# Altium project S12642_0404_etap3_v1.PrjPcb
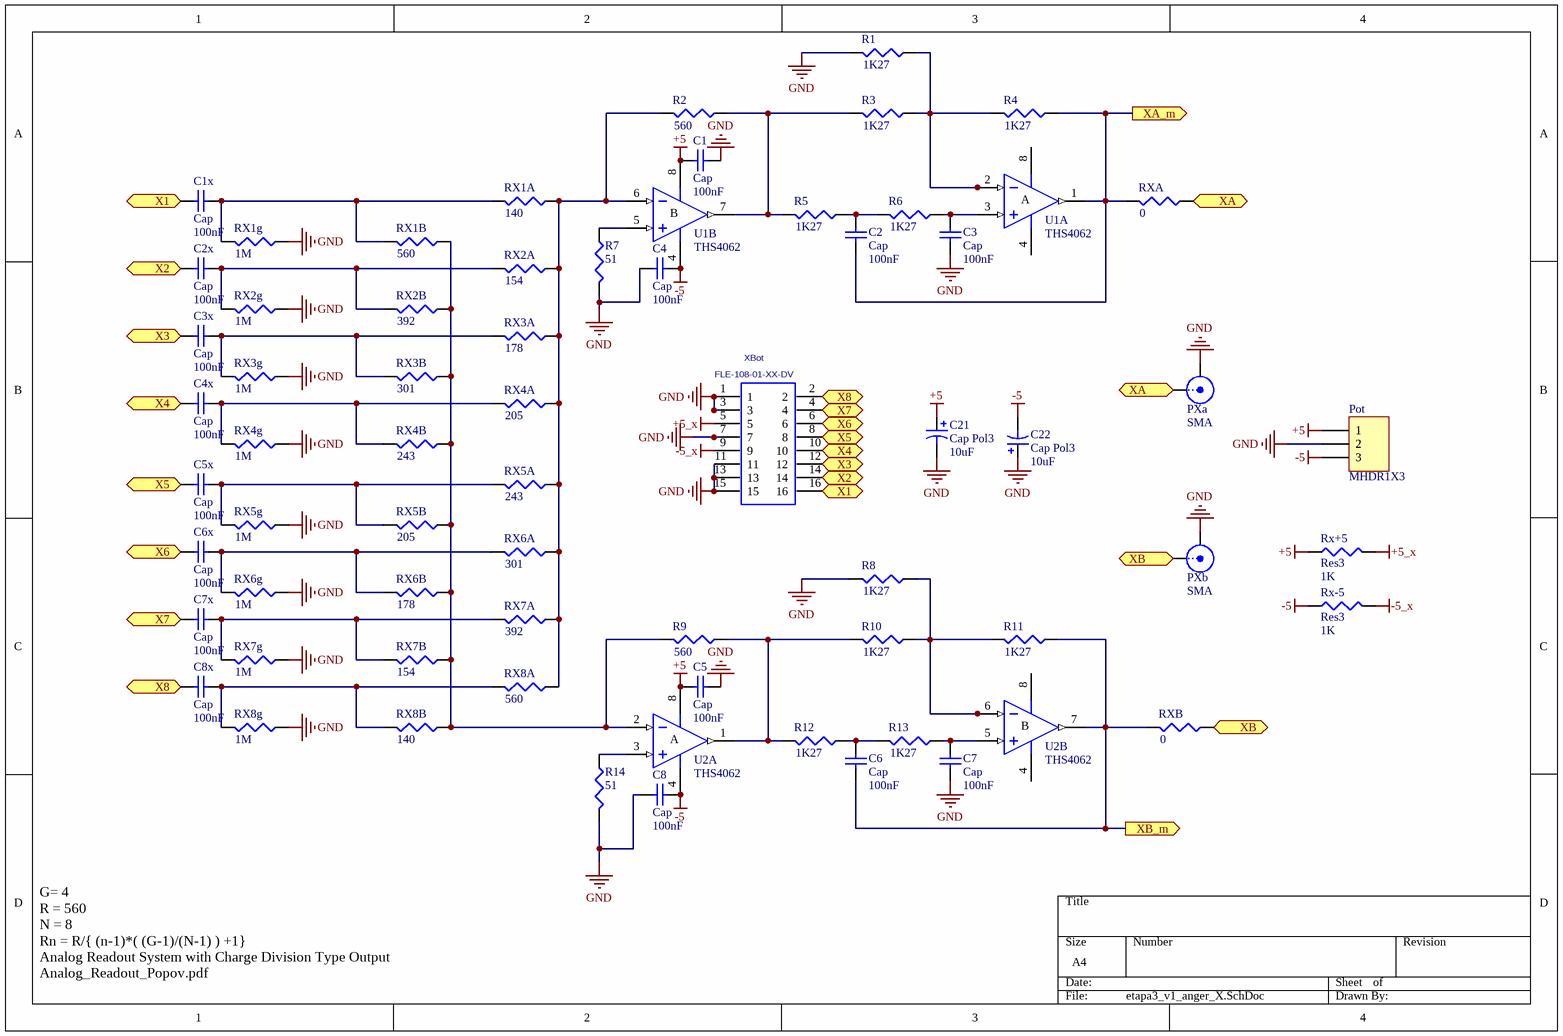
[diagram p0: etapa3_v1_anger_X.SchDoc]
3 sheets, 168 parts. Net scope: flat (ports and power ports of the same name join across sheets).
Board file: etapa_3_v1.PcbDoc
Sheets:
  etapa3_v1_anger_X.SchDoc
  etapa3_v1_anger_Y.SchDoc
  etapa3_v1_timing_1.SchDoc

## Sheet etapa3_v1_anger_X.SchDoc
size A4

### Parts
C1  Cap  value 100nF  [0402]
C1x  Cap  value 100nF  [0402]
C2  Cap  value 100nF  [0402]
C2x  Cap  value 100nF  [0402]
C3  Cap  value 100nF  [0402]
C3x  Cap  value 100nF  [0402]
C4  Cap  value 100nF  [0402]
C4x  Cap  value 100nF  [0402]
C5  Cap  value 100nF  [0402]
C5x  Cap  value 100nF  [0402]
C6  Cap  value 100nF  [0402]
C6x  Cap  value 100nF  [0402]
C7  Cap  value 100nF  [0402]
C7x  Cap  value 100nF  [0402]
C8  Cap  value 100nF  [0402]
C8x  Cap  value 100nF  [0402]
C21  Cap Pol3  value 10uF  [1608[0603]]
C22  Cap Pol3  value 10uF  [1608[0603]]
Pot  MHDR1X3  [MHDR1X3]
PXa  SMA  [SMB_V-RJ45]
PXb  SMA  [SMB_V-RJ45]
R1  value 1K27  [0402]  (hidden comment: Res3)
R2  value 560  [0402]  (hidden comment: Res3)
R3  value 1K27  [0402]  (hidden comment: Res3)
R4  value 1K27  [0402]  (hidden comment: Res3)
R5  value 1K27  [0402]  (hidden comment: Res3)
R6  value 1K27  [0402]  (hidden comment: Res3)
R7  value 51  [0402]  (hidden comment: Res3)
R8  value 1K27  [0402]  (hidden comment: Res3)
R9  value 560  [0402]  (hidden comment: Res3)
R10  value 1K27  [0402]  (hidden comment: Res3)
R11  value 1K27  [0402]  (hidden comment: Res3)
R12  value 1K27  [0402]  (hidden comment: Res3)
R13  value 1K27  [0402]  (hidden comment: Res3)
R14  value 51  [0402]  (hidden comment: Res3)
RX1A  value 140  [0402]  (hidden comment: Res3)
RX1B  value 560  [0402]  (hidden comment: Res3)
RX1g  value 1M  [0402]  (hidden comment: Res3)
RX2A  value 154  [0402]  (hidden comment: Res3)
RX2B  value 392  [0402]  (hidden comment: Res3)
RX2g  value 1M  [0402]  (hidden comment: Res3)
RX3A  value 178  [0402]  (hidden comment: Res3)
RX3B  value 301  [0402]  (hidden comment: Res3)
RX3g  value 1M  [0402]  (hidden comment: Res3)
RX4A  value 205  [0402]  (hidden comment: Res3)
RX4B  value 243  [0402]  (hidden comment: Res3)
RX4g  value 1M  [0402]  (hidden comment: Res3)
RX5A  value 243  [0402]  (hidden comment: Res3)
RX5B  value 205  [0402]  (hidden comment: Res3)
RX5g  value 1M  [0402]  (hidden comment: Res3)
RX6A  value 301  [0402]  (hidden comment: Res3)
RX6B  value 178  [0402]  (hidden comment: Res3)
RX6g  value 1M  [0402]  (hidden comment: Res3)
RX7A  value 392  [0402]  (hidden comment: Res3)
RX7B  value 154  [0402]  (hidden comment: Res3)
RX7g  value 1M  [0402]  (hidden comment: Res3)
RX8A  value 560  [0402]  (hidden comment: Res3)
RX8B  value 140  [0402]  (hidden comment: Res3)
RX8g  value 1M  [0402]  (hidden comment: Res3)
Rx+5  Res3  value 1K  [J1-0603]
Rx-5  Res3  value 1K  [J1-0603]
RXA  value 0  [0402]  (hidden comment: Res3)
RXB  value 0  [0402]  (hidden comment: Res3)
U1  THS4062  [SO-8_M]  (parts A,B of 2)
U2  THS4062  [SO-8_M]  (parts A,B of 2)
XBot  FLE-108-01-XX-DV  [FLE-108-01-XX-DV]

### Ports
X1 (out), X2 (out), X3 (out), X4 (out), X5 (out), X6 (out), X7 (out), X8 (out), XA (out), XA_m (out), XB (out), XB_m (out)

### Nets
+5: C1.1 C5.1 C21.1 Pot.1 Rx+5.1 U1.8(V+) U2.8(V+)
+5_x: Rx+5.2 XBot.5
-5: C4.2 C8.2 C22.2 Pot.3 Rx-5.1 U1.4(V-) U2.4(V-)
-5_x: Rx-5.2 XBot.9
GND: C1.2 C3.2 C4.1 C5.2 C7.2 C8.1 C21.2 C22.1 Pot.2 PXa.2(Y) PXb.2(Y) R1.2 R7.2 R8.2 R14.2 RX1g.1 RX2g.1 RX3g.1 RX4g.1 RX5g.1 RX6g.1 RX7g.1 RX8g.1 XBot.1 XBot.3 XBot.7 XBot.11 XBot.13 XBot.15
NetC1x_1: C1x.1 XBot.16 ; port X1
NetC1x_2: C1x.2 RX1A.2 RX1B.2 RX1g.2
NetC2_1: C2.1 R5.1 R6.2
NetC2_2: C2.2 R4.1 RXA.2 U1.1(OUT) ; port XA_m
NetC2x_1: C2x.1 XBot.14 ; port X2
NetC2x_2: C2x.2 RX2A.2 RX2B.2 RX2g.2
NetC3_1: C3.1 R6.1 U1.3(IN+)
NetC3x_1: C3x.1 XBot.12 ; port X3
NetC3x_2: C3x.2 RX3A.2 RX3B.2 RX3g.2
NetC4x_1: C4x.1 XBot.10 ; port X4
NetC4x_2: C4x.2 RX4A.2 RX4B.2 RX4g.2
NetC5x_1: C5x.1 XBot.8 ; port X5
NetC5x_2: C5x.2 RX5A.2 RX5B.2 RX5g.2
NetC6_1: C6.1 R12.1 R13.2
NetC6_2: C6.2 R11.1 RXB.2 U2.7(OUT) ; port XB_m
NetC6x_1: C6x.1 XBot.6 ; port X6
NetC6x_2: C6x.2 RX6A.2 RX6B.2 RX6g.2
NetC7_1: C7.1 R13.1 U2.5(IN+)
NetC7x_1: C7x.1 XBot.4 ; port X7
NetC7x_2: C7x.2 RX7A.2 RX7B.2 RX7g.2
NetC8x_1: C8x.1 XBot.2 ; port X8
NetC8x_2: C8x.2 RX8A.2 RX8B.2 RX8g.2
NetPXa_1: PXa.1(X) RXA.1 ; port XA
NetPXb_1: PXb.1(X) RXB.1 ; port XB
NetR1_1: R1.1 R3.1 R4.2 U1.2(IN-)
NetR2_1: R2.1 R3.2 R5.2 U1.7(OUT)
NetR2_2: R2.2 RX1A.1 RX2A.1 RX3A.1 RX4A.1 RX5A.1 RX6A.1 RX7A.1 RX8A.1 U1.6(IN-)
NetR7_1: R7.1 U1.5(IN+)
NetR8_1: R8.1 R10.1 R11.2 U2.6(IN-)
NetR9_1: R9.1 R10.2 R12.2 U2.1(OUT)
NetR9_2: R9.2 RX1B.1 RX2B.1 RX3B.1 RX4B.1 RX5B.1 RX6B.1 RX7B.1 RX8B.1 U2.2(IN-)
NetR14_1: R14.1 U2.3(IN+)

### Notes on the sheet
- G= 4
  R = 560
  N = 8
  Rn = R/{ (n-1)*( (G-1)/(N-1) ) +1}
  Analog Readout System with Charge Division Type Output
  Analog_Readout_Popov.pdf
- (in symbol AD8002AR, part A) A
- (in symbol AD8002AR, part B) B

### Library data of the parts
C1 C1x C2 C2x C3 C3x C4 C4x C5 C5x C6 C6x C7 C7x C8 C8x = Cap: Capacitor; Published: 8-Jun-2000; LatestRevisionDate: 17-Jul-2002; LatestRevisionNote: Re-released for DXP Platform.; PackageReference: RAD-0.3; Publisher: Altium Limited; PackageDescription: Radial Cap, Thru-Hole; 2 Leads; 0.3 in Pin Spacing
C21 C22 = Cap Pol3: Polarized Capacitor (Surface Mount); Published: 8-Jun-2000; LatestRevisionDate: 29-May-2009; LatestRevisionNote: IPC-7351 Footprint Added.; PackageReference: C0805; Publisher: Altium Limited; PackageDescription: Chip Capacitor
Pot = MHDR1X3: Header, 3-Pin; LatestRevisionDate: 17-Jul-2002; LatestRevisionNote: Re-released for DXP Platform.; Publisher: Altium Limited
PXa PXb = SMB: SMB Straight Connector; LatestRevisionDate: 17-Jul-2002; LatestRevisionNote: Re-released for DXP Platform.; Publisher: Altium Limited
R1-R14 RX1A RX1B RX1g RX2A RX2B RX2g RX3A RX3B RX3g RX4A RX4B RX4g RX5A RX5B RX5g RX6A RX6B RX6g RX7A RX7B RX7g RX8A RX8B RX8g Rx+5 Rx-5 RXA RXB = Res3: Resistor; Published: 8-Jun-2000; LatestRevisionDate: 29-May-2009; LatestRevisionNote: IPC-7351 Footprint Added.; PackageReference: J1-0603; Publisher: Altium Limited; PackageDescription: Chip Resistor
U1 U2 = AD8002AR: Dual 600MHz, 50mW Current Feedback Amplifier; Published: 8-Jun-2000; LatestRevisionDate: 13-Apr-2006; LatestRevisionNote: IPC-7351 Footprint Added.; DatasheetVersion: REV. C 1999; PackageVersion: revA; PackageReference: SO-8; Publisher: Altium Limited; PackageDescription: 8-Pin Small Outline Integrated Circuit 1.27 mm Pitch; Code_JEDEC: MS-012-AA; Code_IPC: SOIC127P600-8; ComponentLink1Description: Manufacturer Link; ComponentLink1URL: http://www.analog.com/en/prod/0,,759_786_AD8002%2C00.html; ComponentLink2Description: Datasheet; ComponentLink2URL: http://www.analog.com/UploadedFiles/Data_Sheets/147523773AD8002_d.pdf
XBot = FLE-108-01-XX-DV: DUAL ROW 0.050'' STRIP ASSEMBLY.; MANUFACTURER: SAMTEC; CREATED: December 2, 2014 - Wendy Xin; PCB DECAL: FLE-108-01-XX-DV

## Sheet etapa3_v1_anger_Y.SchDoc
size A4
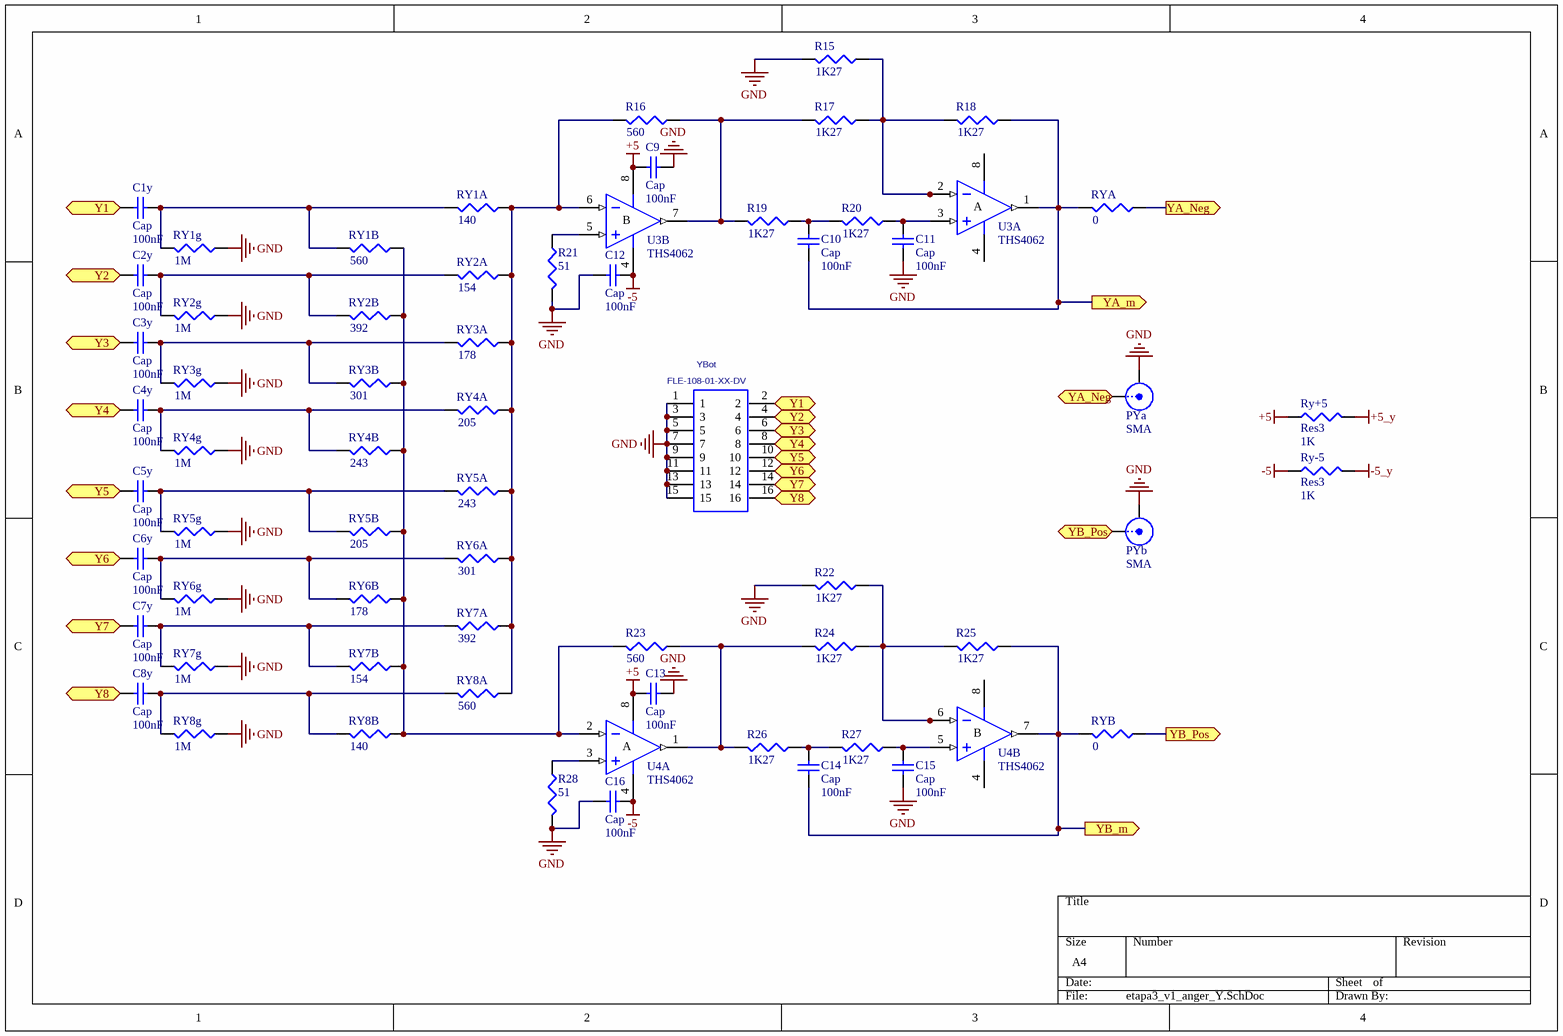
[diagram p1: etapa3_v1_anger_Y.SchDoc]

### Parts
(Parts that share a designator on the sheet are numbered #1, #2 ... from top to bottom, then left to right.)
C1y  Cap  value 100nF  [0402]
C2y  Cap  value 100nF  [0402]
C3y  Cap  value 100nF  [0402]
C4y  Cap  value 100nF  [0402]
C5y  Cap  value 100nF  [0402]
C6y  Cap  value 100nF  [0402]
C7y  Cap  value 100nF  [0402]
C8y  Cap  value 100nF  [0402]
C9#1  Cap  value 100nF  [0402]
C10#1  Cap  value 100nF  [0402]
C11#1  Cap  value 100nF  [0402]
C12#1  Cap  value 100nF  [0402]
C13#1  Cap  value 100nF  [0402]
C14#1  Cap  value 100nF  [0402]
C15#1  Cap  value 100nF  [0402]
C16  Cap  value 100nF  [0402]
PYa  SMA  [SMB_V-RJ45]
PYb  SMA  [SMB_V-RJ45]
R15#1  value 1K27  [0402]  (hidden comment: Res3)
R16#1  value 560  [0402]  (hidden comment: Res3)
R17#1  value 1K27  [0402]  (hidden comment: Res3)
R18#1  value 1K27  [0402]  (hidden comment: Res3)
R19#1  value 1K27  [0402]  (hidden comment: Res3)
R20#1  value 1K27  [0402]  (hidden comment: Res3)
R21#1  value 51  [0402]  (hidden comment: Res3)
R22  value 1K27  [0402]  (hidden comment: Res3)
R23  value 560  [0402]  (hidden comment: Res3)
R24  value 1K27  [0402]  (hidden comment: Res3)
R25#1  value 1K27  [0402]  (hidden comment: Res3)
R26  value 1K27  [0402]  (hidden comment: Res3)
R27  value 1K27  [0402]  (hidden comment: Res3)
R28  value 51  [0402]  (hidden comment: Res3)
RY1A  value 140  [0402]  (hidden comment: Res3)
RY1B  value 560  [0402]  (hidden comment: Res3)
RY1g  value 1M  [0402]  (hidden comment: Res3)
RY2A  value 154  [0402]  (hidden comment: Res3)
RY2B  value 392  [0402]  (hidden comment: Res3)
RY2g  value 1M  [0402]  (hidden comment: Res3)
RY3A  value 178  [0402]  (hidden comment: Res3)
RY3B  value 301  [0402]  (hidden comment: Res3)
RY3g  value 1M  [0402]  (hidden comment: Res3)
RY4A  value 205  [0402]  (hidden comment: Res3)
RY4B  value 243  [0402]  (hidden comment: Res3)
RY4g  value 1M  [0402]  (hidden comment: Res3)
RY5A  value 243  [0402]  (hidden comment: Res3)
RY5B  value 205  [0402]  (hidden comment: Res3)
RY5g  value 1M  [0402]  (hidden comment: Res3)
RY6A  value 301  [0402]  (hidden comment: Res3)
RY6B  value 178  [0402]  (hidden comment: Res3)
RY6g  value 1M  [0402]  (hidden comment: Res3)
RY7A  value 392  [0402]  (hidden comment: Res3)
RY7B  value 154  [0402]  (hidden comment: Res3)
RY7g  value 1M  [0402]  (hidden comment: Res3)
RY8A  value 560  [0402]  (hidden comment: Res3)
RY8B  value 140  [0402]  (hidden comment: Res3)
RY8g  value 1M  [0402]  (hidden comment: Res3)
Ry+5  Res3  value 1K  [J1-0603]
Ry-5  Res3  value 1K  [J1-0603]
RYA  value 0  [0402]  (hidden comment: Res3)
RYB  value 0  [0402]  (hidden comment: Res3)
U3#1  THS4062  [SO-8_M]  (parts A,B of 2)
U4  THS4062  [SO-8_M]  (parts A,B of 2)
YBot  FLE-108-01-XX-DV  [FLE-108-01-XX-DV]

### Ports
Y1 (out), Y2 (out), Y3 (out), Y4 (out), Y5 (out), Y6 (out), Y7 (out), Y8 (out), YA_m (out), YA_Neg (out), YB_m (out), YB_Pos (out)

### Nets
+5: C9#1.1 C13#1.1 Ry+5.1 U3#1.8(V+) U4.8(V+)
+5_y: Ry+5.2
-5: C12#1.2 C16.2 Ry-5.1 U3#1.4(V-) U4.4(V-)
-5_y: Ry-5.2
GND: C9#1.2 C11#1.2 C12#1.1 C13#1.2 C15#1.2 C16.1 PYa.2(Y) PYb.2(Y) R15#1.2 R21#1.2 R22.2 R28.2 RY1g.1 RY2g.1 RY3g.1 RY4g.1 RY5g.1 RY6g.1 RY7g.1 RY8g.1 YBot.1 YBot.3 YBot.5 YBot.7 YBot.9 YBot.11 YBot.13 YBot.15
NetC1y_1: C1y.1 YBot.2 ; port Y1
NetC1y_2: C1y.2 RY1A.2 RY1B.2 RY1g.2
NetC2y_1: C2y.1 YBot.4 ; port Y2
NetC2y_2: C2y.2 RY2A.2 RY2B.2 RY2g.2
NetC3y_1: C3y.1 YBot.6 ; port Y3
NetC3y_2: C3y.2 RY3A.2 RY3B.2 RY3g.2
NetC4y_1: C4y.1 YBot.8 ; port Y4
NetC4y_2: C4y.2 RY4A.2 RY4B.2 RY4g.2
NetC5y_1: C5y.1 YBot.10 ; port Y5
NetC5y_2: C5y.2 RY5A.2 RY5B.2 RY5g.2
NetC6y_1: C6y.1 YBot.12 ; port Y6
NetC6y_2: C6y.2 RY6A.2 RY6B.2 RY6g.2
NetC7y_1: C7y.1 YBot.14 ; port Y7
NetC7y_2: C7y.2 RY7A.2 RY7B.2 RY7g.2
NetC8y_1: C8y.1 YBot.16 ; port Y8
NetC8y_2: C8y.2 RY8A.2 RY8B.2 RY8g.2
NetC10#1_1: C10#1.1 R19#1.1 R20#1.2
NetC10#1_2: C10#1.2 R18#1.1 RYA.2 U3#1.1(OUT) ; port YA_m
NetC11#1_1: C11#1.1 R20#1.1 U3#1.3(IN+)
NetC14#1_1: C14#1.1 R26.1 R27.2
NetC14#1_2: C14#1.2 R25#1.1 RYB.2 U4.7(OUT) ; port YB_m
NetC15#1_1: C15#1.1 R27.1 U4.5(IN+)
NetPYa_1: PYa.1(X) RYA.1 ; port YA_Neg
NetPYb_1: PYb.1(X) RYB.1 ; port YB_Pos
NetR15#1_1: R15#1.1 R17#1.1 R18#1.2 U3#1.2(IN-)
NetR16#1_1: R16#1.1 R17#1.2 R19#1.2 U3#1.7(OUT)
NetR16#1_2: R16#1.2 RY1A.1 RY2A.1 RY3A.1 RY4A.1 RY5A.1 RY6A.1 RY7A.1 RY8A.1 U3#1.6(IN-)
NetR21#1_1: R21#1.1 U3#1.5(IN+)
NetR22_1: R22.1 R24.1 R25#1.2 U4.6(IN-)
NetR23_1: R23.1 R24.2 R26.2 U4.1(OUT)
NetR23_2: R23.2 RY1B.1 RY2B.1 RY3B.1 RY4B.1 RY5B.1 RY6B.1 RY7B.1 RY8B.1 U4.2(IN-)
NetR28_1: R28.1 U4.3(IN+)

### Notes on the sheet
- (in symbol AD8002AR, part A) A
- (in symbol AD8002AR, part B) B

### Library data of the parts
C1y C2y C3y C4y C5y C6y C7y C8y C9#1 C10#1 C11#1 C12#1 C13#1 C14#1 C15#1 C16 = Cap: Capacitor; Published: 8-Jun-2000; LatestRevisionDate: 17-Jul-2002; LatestRevisionNote: Re-released for DXP Platform.; PackageReference: RAD-0.3; Publisher: Altium Limited; PackageDescription: Radial Cap, Thru-Hole; 2 Leads; 0.3 in Pin Spacing
PYa PYb = SMB: SMB Straight Connector; LatestRevisionDate: 17-Jul-2002; LatestRevisionNote: Re-released for DXP Platform.; Publisher: Altium Limited
R15#1 R16#1 R17#1 R18#1 R19#1 R20#1 R21#1 R22-R24 R25#1 R26-R28 RY1A RY1B RY1g RY2A RY2B RY2g RY3A RY3B RY3g RY4A RY4B RY4g RY5A RY5B RY5g RY6A RY6B RY6g RY7A RY7B RY7g RY8A RY8B RY8g Ry+5 Ry-5 RYA RYB = Res3: Resistor; Published: 8-Jun-2000; LatestRevisionDate: 29-May-2009; LatestRevisionNote: IPC-7351 Footprint Added.; PackageReference: J1-0603; Publisher: Altium Limited; PackageDescription: Chip Resistor
U3#1 U4 = AD8002AR: as U1 on sheet etapa3_v1_anger_X; Published: 8-Jun-2000; LatestRevisionDate: 13-Apr-2006; LatestRevisionNote: IPC-7351 Footprint Added.; DatasheetVersion: REV. C 1999; PackageVersion: revA; PackageReference: SO-8; Publisher: Altium Limited; PackageDescription: 8-Pin Small Outline Integrated Circuit 1.27 mm Pitch; Code_JEDEC: MS-012-AA; Code_IPC: SOIC127P600-8; ComponentLink1Description: Manufacturer Link; ComponentLink1URL: http://www.analog.com/en/prod/0,,759_786_AD8002%2C00.html; ComponentLink2Description: Datasheet; ComponentLink2URL: http://www.analog.com/UploadedFiles/Data_Sheets/147523773AD8002_d.pdf
YBot = FLE-108-01-XX-DV: as XBot on sheet etapa3_v1_anger_X; CREATED: December 2, 2014 - Wendy Xin; PCB DECAL: FLE-108-01-XX-DV

## Sheet etapa3_v1_timing_1.SchDoc
size A4
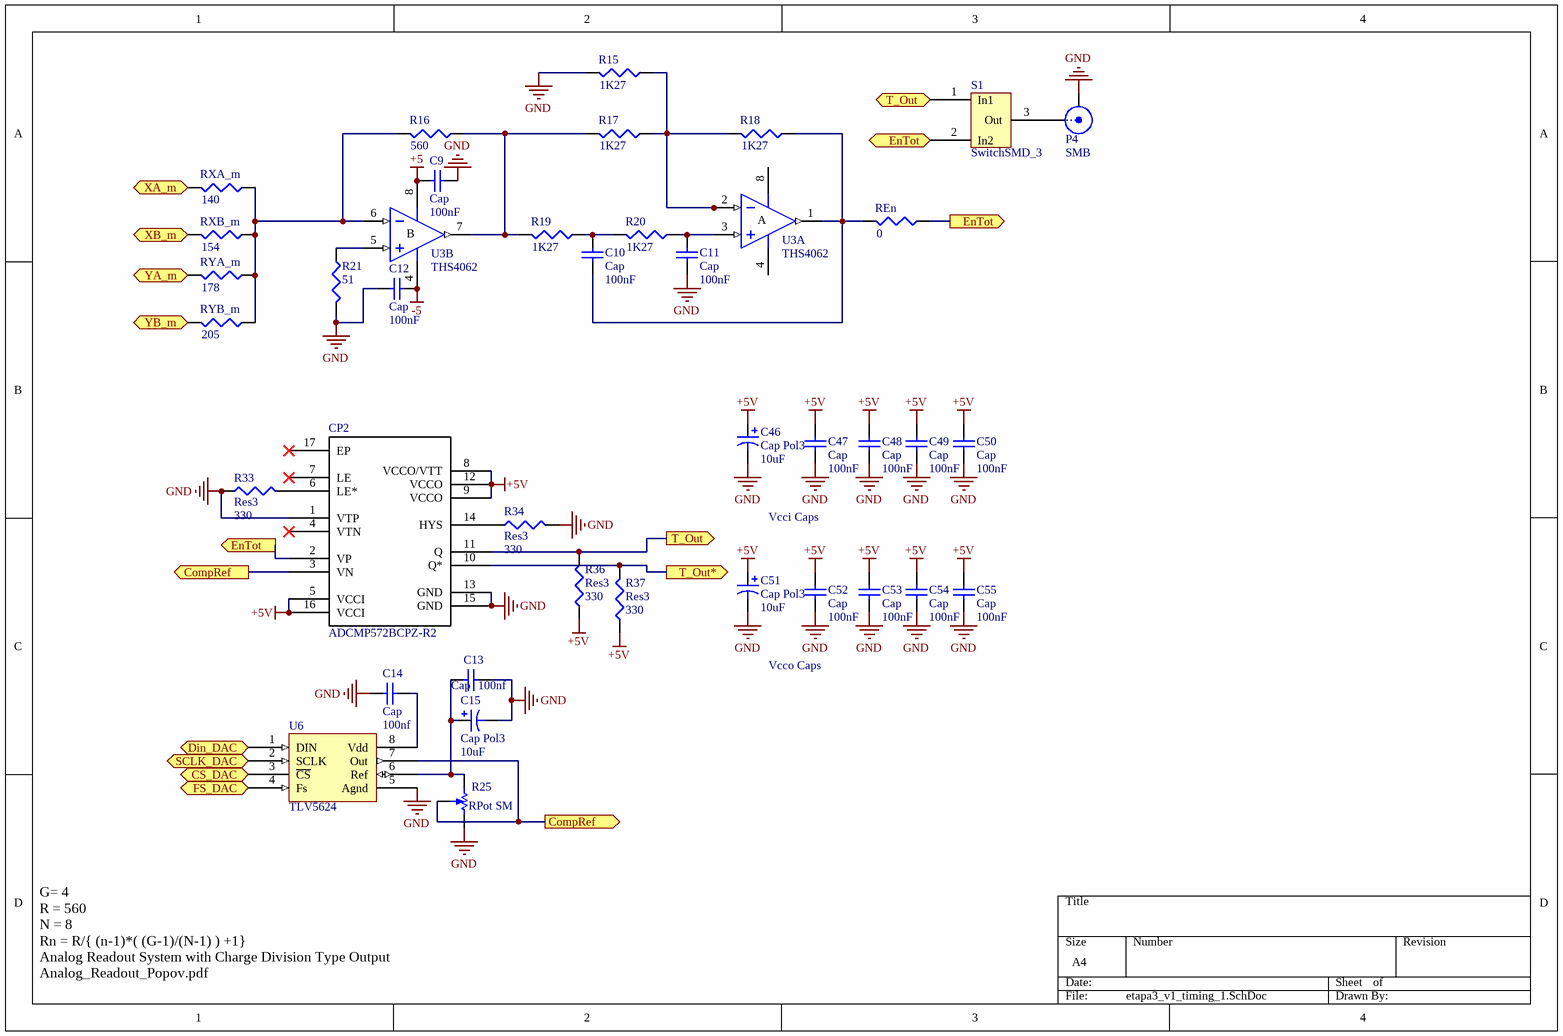
[diagram p2: etapa3_v1_timing_1.SchDoc]

### Parts
(Parts that share a designator on the sheet are numbered #1, #2 ... from top to bottom, then left to right.)
C9#2  Cap  value 100nF  [0402]
C10#2  Cap  value 100nF  [0402]
C11#2  Cap  value 100nF  [0402]
C12#2  Cap  value 100nF  [0402]
C13#2  Cap  value 100nf  [J1-0603]
C14#2  Cap  value 100nf  [J1-0603]
C15#2  Cap Pol3  value 10uF  [6-0805_N]
C46  Cap Pol3  value 10uF  [1608[0603]]
C47  Cap  value 100nF  [0402]
C48  Cap  value 100nF  [0402]
C49  Cap  value 100nF  [0402]
C50  Cap  value 100nF  [0402]
C51  Cap Pol3  value 10uF  [1608[0603]]
C52  Cap  value 100nF  [0402]
C53  Cap  value 100nF  [0402]
C54  Cap  value 100nF  [0402]
C55  Cap  value 100nF  [0402]
CP2  ADCMP572BCPZ-R2  [CP_16_3]
P4  SMB  [SMA-SMD]
R15#2  value 1K27  [0402]  (hidden comment: Res3)
R16#2  value 560  [0402]  (hidden comment: Res3)
R17#2  value 1K27  [0402]  (hidden comment: Res3)
R18#2  value 1K27  [0402]  (hidden comment: Res3)
R19#2  value 1K27  [0402]  (hidden comment: Res3)
R20#2  value 1K27  [0402]  (hidden comment: Res3)
R21#2  value 51  [0402]  (hidden comment: Res3)
R25#2  RPot SM  [POT4MM-2]
R33  Res3  value 330  [0402]
R34  Res3  value 330  [0402]
R36  Res3  value 330  [0402]
R37  Res3  value 330  [0402]
REn  value 0  [0402]  (hidden comment: Res3)
RXA_m  value 140  [0402]  (hidden comment: Res3)
RXB_m  value 154  [0402]  (hidden comment: Res3)
RYA_m  value 178  [0402]  (hidden comment: Res3)
RYB_m  value 205  [0402]  (hidden comment: Res3)
S1  SwitchSMD_3  [SwitchSMD_0603]
U3#2  THS4062  [SO-8_M]  (parts A,B of 2)
U6  TLV5624  [SO-8_N]

### Ports
CompRef (out), CS_DAC (out), Din_DAC (out), EnTot (out), FS_DAC (out), SCLK_DAC (out), T_Out (out), T_Out* (out), XA_m (out), XB_m (out), YA_m (out), YB_m (out)

### Nets
+5: C9#2.1 U3#2.8(V+)
+5V: C46.1 C47.2 C48.2 C49.2 C50.2 C51.1 C52.2 C53.2 C54.2 C55.2 CP2.5(VCCI) CP2.8(VCCO/VTT) CP2.9(VCCO) CP2.12(VCCO) CP2.16(VCCI) R36.1 R37.1
-5: C12#2.2 U3#2.4(V-)
GND: C9#2.2 C11#2.2 C12#2.1 C13#2.2 C14#2.2 C15#2.2 C46.2 C47.1 C48.1 C49.1 C50.1 C51.2 C52.1 C53.1 C54.1 C55.1 CP2.1(VTP) CP2.13(GND) CP2.15(GND) P4.2(Y) R15#2.2 R21#2.2 R25#2.CW(+) R33.1 R34.2 U6.5(Agnd)
NetC2_2: RXA_m.2 ; port XA_m
NetC6_2: RXB_m.2 ; port XB_m
NetC10#1_2: RYA_m.2 ; port YA_m
NetC10#2_1: C10#2.1 R19#2.1 R20#2.2
NetC10#2_2: C10#2.2 R18#2.1 REn.2 U3#2.1(OUT)
NetC11#2_1: C11#2.1 R20#2.1 U3#2.3(IN+)
NetC13#2_1: C13#2.1 C15#2.1 R25#2.CCW(-) U6.6(Ref)
NetC14#1_2: RYB_m.2 ; port YB_m
NetC14#2_1: C14#2.1 U6.8(Vdd)
NetCP2_2: CP2.2(VP) REn.1 S1.2(In2) ; port EnTot
NetCP2_3: CP2.3(VN) R25#2.W U6.7(Out) ; port CompRef
NetCP2_6: CP2.6(LE*) R33.2
NetCP2_10: CP2.10(Q*) R37.2 ; port T_Out*
NetCP2_11: CP2.11(Q) R36.2 S1.1(In1) ; port T_Out
NetCP2_14: CP2.14(HYS) R34.1
NetP4_1: P4.1(X) S1.3(Out)
NetR15#2_1: R15#2.1 R17#2.1 R18#2.2 U3#2.2(IN-)
NetR16#2_1: R16#2.1 R17#2.2 R19#2.2 U3#2.7(OUT)
NetR16#2_2: R16#2.2 RXA_m.1 RXB_m.1 RYA_m.1 RYB_m.1 U3#2.6(IN-)
NetR21#2_1: R21#2.1 U3#2.5(IN+)
NetU6_1: U6.1(DIN) ; port Din_DAC
NetU6_2: U6.2(SCLK) ; port SCLK_DAC
NetU6_3: U6.3(~{CS}) ; port CS_DAC
NetU6_4: U6.4(Fs) ; port FS_DAC

Not connected (* = marked no-connect by the designer): CP2 4(VTN)* 7(LE)* 17(EP)*

### Notes on the sheet
- Vcci Caps
- Vcco Caps
- G= 4
  R = 560
  N = 8
  Rn = R/{ (n-1)*( (G-1)/(N-1) ) +1}
  Analog Readout System with Charge Division Type Output
  Analog_Readout_Popov.pdf
- (in symbol AD8002AR, part A) A
- (in symbol AD8002AR, part B) B

### Library data of the parts
C9#2 C10#2 C11#2 C12#2 C13#2 C14#2 C47-C50 C52-C55 = Cap: Capacitor; Published: 8-Jun-2000; LatestRevisionDate: 17-Jul-2002; LatestRevisionNote: Re-released for DXP Platform.; PackageReference: RAD-0.3; Publisher: Altium Limited; PackageDescription: Radial Cap, Thru-Hole; 2 Leads; 0.3 in Pin Spacing
C15#2 C46 C51 = Cap Pol3: Polarized Capacitor (Surface Mount); Published: 8-Jun-2000; LatestRevisionDate: 29-May-2009; LatestRevisionNote: IPC-7351 Footprint Added.; PackageReference: C0805; Publisher: Altium Limited; PackageDescription: Chip Capacitor
CP2 = ADCMP572BCPZ-R2: Imported; Manufacturer_Part_Number: ADCMP572BCPZ-R2; Vendor: Vendor; RefDes: RefDes; Type: DEV; Value: Value
P4 = SMB: SMB Straight Connector; LatestRevisionDate: 17-Jul-2002; LatestRevisionNote: Re-released for DXP Platform.; Publisher: Altium Limited
R15#2 R16#2 R17#2 R18#2 R19#2 R20#2 R21#2 R33 R34 R36 R37 REn RXA_m RXB_m RYA_m RYB_m = Res3: Resistor; Published: 8-Jun-2000; LatestRevisionDate: 29-May-2009; LatestRevisionNote: IPC-7351 Footprint Added.; PackageReference: J1-0603; Publisher: Altium Limited; PackageDescription: Chip Resistor
R25#2 = RPot SM: Square Trimming Potentiometer; Published: 17-Dec-2003; DatasheetVersion: Oct-2003; PackageReference: POT4MM-2; Publisher: Altium Limited; PackageDescription: Square Trimming Potentiometer; ComponentLink1Description: Manufacturer Link; ComponentLink1URL: http://bourns.com/2/search.html
U3#2 = AD8002AR: as U1 on sheet etapa3_v1_anger_X; Published: 8-Jun-2000; LatestRevisionDate: 13-Apr-2006; LatestRevisionNote: IPC-7351 Footprint Added.; DatasheetVersion: REV. C 1999; PackageVersion: revA; PackageReference: SO-8; Publisher: Altium Limited; PackageDescription: 8-Pin Small Outline Integrated Circuit 1.27 mm Pitch; Code_JEDEC: MS-012-AA; Code_IPC: SOIC127P600-8; ComponentLink1Description: Manufacturer Link; ComponentLink1URL: http://www.analog.com/en/prod/0,,759_786_AD8002%2C00.html; ComponentLink2Description: Datasheet; ComponentLink2URL: http://www.analog.com/UploadedFiles/Data_Sheets/147523773AD8002_d.pdf
U6 = TLV5624: DAC, internal reference, SPI

## Nets that join several sheets
+5: etapa3_v1_anger_X (7 pins), etapa3_v1_anger_Y (5 pins), etapa3_v1_timing_1 (C9#2.1 U3#2.8)
-5: etapa3_v1_anger_X (7 pins), etapa3_v1_anger_Y (5 pins), etapa3_v1_timing_1 (C12#2.2 U3#2.4)
GND: etapa3_v1_anger_X (29 pins), etapa3_v1_anger_Y (28 pins), etapa3_v1_timing_1 (26 pins)
NetC2_2: etapa3_v1_anger_X (C2.2 R4.1 RXA.2 U1.1), etapa3_v1_timing_1 (RXA_m.2)
NetC6_2: etapa3_v1_anger_X (C6.2 R11.1 RXB.2 U2.7), etapa3_v1_timing_1 (RXB_m.2)
NetC10#1_2: etapa3_v1_anger_Y (C10#1.2 R18#1.1 RYA.2 U3#1.1), etapa3_v1_timing_1 (RYA_m.2)
NetC14#1_2: etapa3_v1_anger_Y (C14#1.2 R25#1.1 RYB.2 U4.7), etapa3_v1_timing_1 (RYB_m.2)